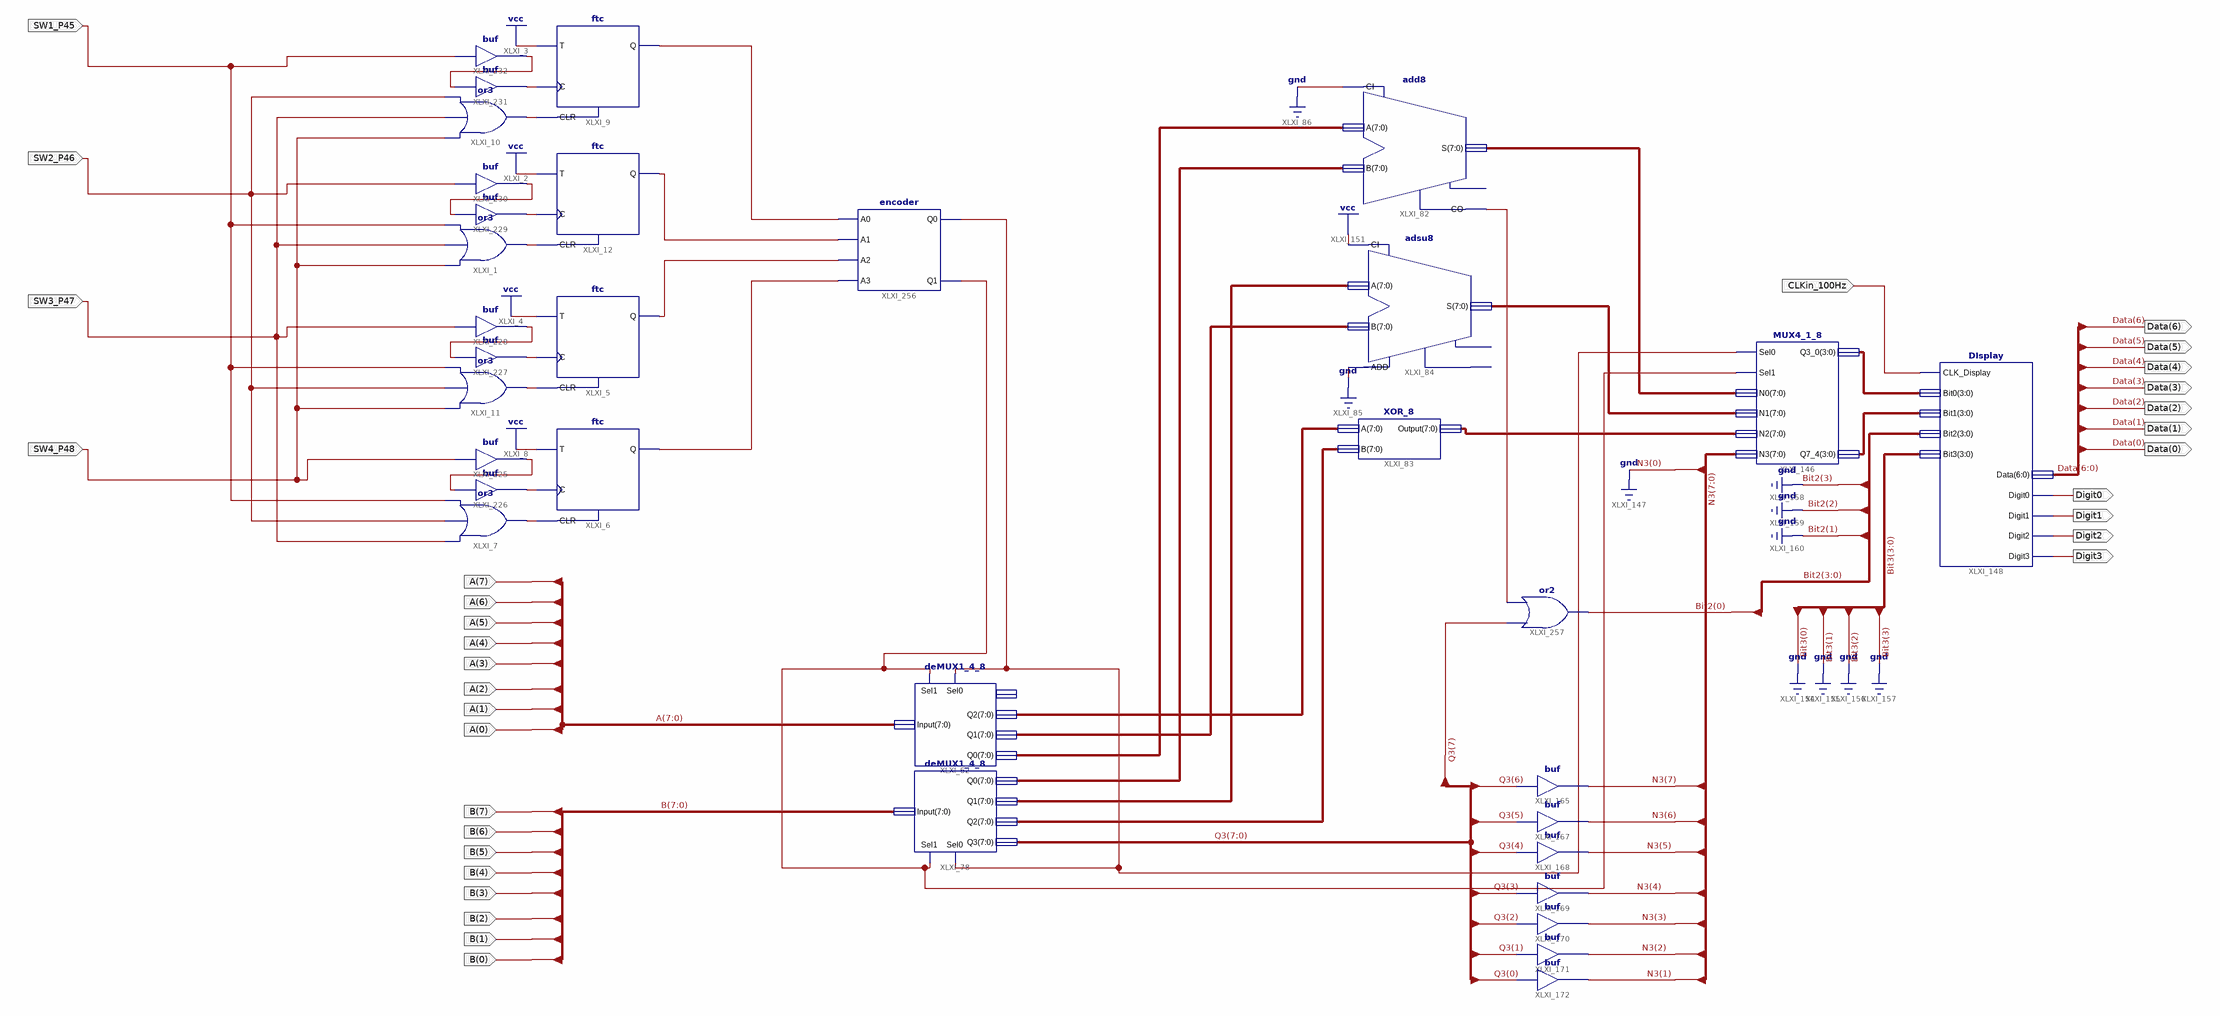
[diagram p0: schematic sheet 1]
// Xilinx ISE schematic lab9.sch (spartan6) as structural Verilog: 32 symbols, 32 ports
module lab9 (
  input  [7:0] A,
  input  [7:0] B,
  input  CLKin_100Hz,
  input  SW2_P46,
  input  SW3_P47,
  input  SW4_P48,
  input  SW1_P45,
  output Digit0,
  output Digit1,
  output Digit2,
  output Digit3,
  output [6:0] Data
);

  wire XLXN_43, XLXN_44, XLXN_45, XLXN_54, XLXN_119, XLXN_120, XLXN_390, XLXN_392, XLXN_398, XLXN_400,
       XLXN_403, XLXN_405, XLXN_408, XLXN_410, XLXN_461, XLXN_462, XLXN_463, XLXN_464, XLXN_476;
  wire [0:0] Bit2;
  wire [3:0] XLXN_232, XLXN_233;
  wire [7:0] Q3, XLXN_149, XLXN_150, XLXN_152, XLXN_153, XLXN_221, XLXN_222, XLXN_224, XLXN_292, XLXN_293;
  wire [7:1] N3;

  or XLXI_1 (XLXN_43, SW4_P48, SW3_P47, SW1_P45);
  ftc XLXI_5 (.C(XLXN_398), .CLR(XLXN_54), .T(1'b1), .Q(XLXN_463));
  ftc XLXI_6 (.C(XLXN_390), .CLR(XLXN_45), .T(1'b1), .Q(XLXN_464));
  or XLXI_7 (XLXN_45, SW3_P47, SW2_P46, SW1_P45);
  ftc XLXI_9 (.C(XLXN_408), .CLR(XLXN_44), .T(1'b1), .Q(XLXN_461));
  or XLXI_10 (XLXN_44, SW4_P48, SW3_P47, SW2_P46);
  or XLXI_11 (XLXN_54, SW4_P48, SW2_P46, SW1_P45);
  ftc XLXI_12 (.C(XLXN_403), .CLR(XLXN_43), .T(1'b1), .Q(XLXN_462));
  deMUX1_4_8 XLXI_62 (
    .Input(A), .Sel1(XLXN_119), .Sel0(XLXN_120), .Q0(XLXN_149), .Q2(XLXN_152), .Q1(XLXN_292));  // open: Q3
  deMUX1_4_8 XLXI_78 (
    .Input(B), .Sel1(XLXN_119), .Sel0(XLXN_120), .Q0(XLXN_150), .Q2(XLXN_153), .Q1(XLXN_293), .Q3(Q3));
  add8 XLXI_82 (.A(XLXN_149), .B(XLXN_150), .CI(1'b0), .CO(XLXN_476), .S(XLXN_221));  // open: OFL
  adsu8 XLXI_84 (.A(XLXN_293), .ADD(1'b0), .B(XLXN_292), .CI(1'b1), .S(XLXN_222));  // open: CO, OFL
  XOR_8 XLXI_83 (.A(XLXN_152), .B(XLXN_153), .Output(XLXN_224));
  MUX4_1_8 XLXI_146 (
    .Sel0(XLXN_120), .Sel1(XLXN_119), .N0(XLXN_221), .N1(XLXN_222), .N2(XLXN_224), .N3({N3, 1'b0}),
    .Q3_0(XLXN_232), .Q7_4(XLXN_233));
  DIsplay XLXI_148 (
    .CLK_Display(CLKin_100Hz), .Data(Data), .Digit0(Digit0), .Digit1(Digit1), .Digit2(Digit2),
    .Digit3(Digit3), .Bit3(4'b0000), .Bit2({3'b000, Bit2[0]}), .Bit0(XLXN_232), .Bit1(XLXN_233));
  buf XLXI_165 (N3[7], Q3[6]);
  buf XLXI_168 (N3[5], Q3[4]);
  buf XLXI_169 (N3[4], Q3[3]);
  buf XLXI_170 (N3[3], Q3[2]);
  buf XLXI_167 (N3[6], Q3[5]);
  buf XLXI_171 (N3[2], Q3[1]);
  buf XLXI_172 (N3[1], Q3[0]);
  buf XLXI_225 (XLXN_392, SW4_P48);
  buf XLXI_226 (XLXN_390, XLXN_392);
  buf XLXI_227 (XLXN_398, XLXN_400);
  buf XLXI_228 (XLXN_400, SW3_P47);
  buf XLXI_229 (XLXN_403, XLXN_405);
  buf XLXI_230 (XLXN_405, SW2_P46);
  buf XLXI_231 (XLXN_408, XLXN_410);
  buf XLXI_232 (XLXN_410, SW1_P45);
  encoder XLXI_256 (.A0(XLXN_461), .A2(XLXN_463), .Q0(XLXN_120), .Q1(XLXN_119), .A1(XLXN_462), .A3(XLXN_464));
  or XLXI_257 (Bit2[0], Q3[7], XLXN_476);
endmodule
